# Altium project BeagleBoneBlackRTC.PrjPCB
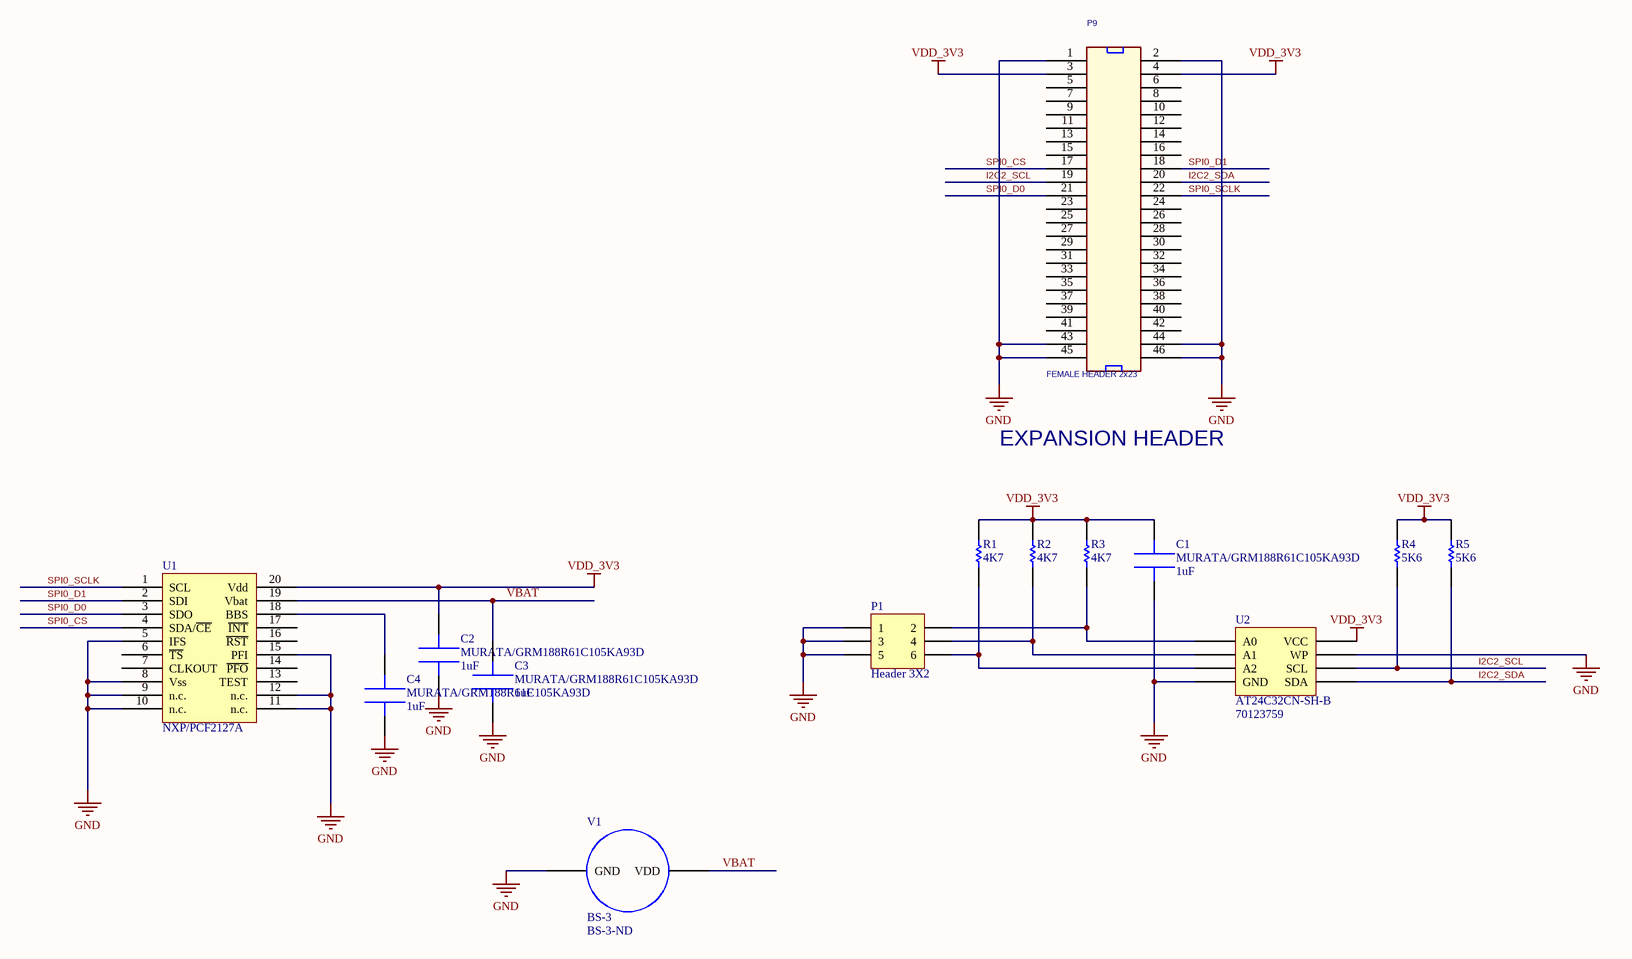
[diagram p0: BeagleBoneBlackRTC.SchDoc]
1 sheet, 14 parts. Net scope: global (net labels, ports and power ports of the same name join across sheets).
Board file: BeagleBoneBlack.PcbDoc

## Sheet BeagleBoneBlackRTC.SchDoc: BeagleBone Black RTC Cape
size B; Author: Anh Luong; CompanyName: University of Utah - WiESEL; DrawnBy: Anh Luong; Organization: WiESEL; Address1: Anh Luong; Address2: 50 S. Central Campus Dr.; Address3: Rm 1381 MEB; Address4: Salt Lake City, UT 84112-9206; DocumentNumber: 0; Revision: 2; SheetNumber: 1; SheetTotal: 1; PageSetup: Record=PageOptions|CenterHorizontal=True|CenterVertical=True|PrintScale=1.00|XCorrection=1.00|YCorrection=1.00|PrintKind=1|BorderSize=5000000|LeftOffset=0|BottomOffset=0|Orientation=2|PaperLength=1000|PaperWidth=1000|Scale=100|PaperSource=7|PrintQuality=-4|MediaType=1|DitherType=10|PaperKind=A5|PrintScaleMode=1; ImagePath: C:\Users\Anh\Dropbox\WiESEL\Documents\WiESEL.bmp; ProjectName: BeagleBone Black RTC Cape

### Parts
C1  MURATA/GRM188R61C105KA93D  value 1uF  [CAPC1608X09N (0603)]
C2  MURATA/GRM188R61C105KA93D  value 1uF  [CAPC1608X09N (0603)]
C3  MURATA/GRM188R61C105KA93D  value 1uF  [CAPC1608X09N (0603)]
C4  MURATA/GRM188R61C105KA93D  value 1uF  [CAPC1608X09N (0603)]
P1  Header 3X2  [HDR2X3]
P9  FEMALE HEADER 2x23  [HEADER23X2]
R1  4K7  [RES0603]
R2  4K7  [RES0603]
R3  4K7  [RES0603]
R4  5K6  [RES0603]
R5  5K6  [RES0603]
U1  NXP/PCF2127A  [NXP/PCF2127A SOT163-1]
U2  AT24C32CN-SH-B  Supplier Part Number 1: 70123759  [SOIC127P600X175-8N]
V1  BS-3  Supplier Part Number 1: BS-3-ND  [CR2032TH]

### Nets
GND: C1.1 C2.1 C3.1 C4.1 P1.1 P1.3 P1.5 P9.1 P9.2 P9.43 P9.44 P9.45 P9.46 U1.5(IFS) U1.8(Vss) U1.9(n.c.) U1.10(n.c.) U1.11(n.c.) U1.12(n.c.) U1.15(PFI) U2.4(GND) U2.7(WP) V1.0(GND)
VDD_3V3: C1.2 C2.2 P9.3 P9.4 R1.2 R2.2 R3.2 R4.2 R5.2 U1.20(Vdd) U2.8(VCC)
I2C2_SCL: P9.19 R4.1 U2.6(SCL)
I2C2_SDA: P9.20 R5.1 U2.5(SDA)
SPI0_CS: P9.17 U1.4(SDA/~{CE})
SPI0_D0: P9.21 U1.3(SDO)
SPI0_D1: P9.18 U1.2(SDI)
SPI0_SCLK: P9.22 U1.1(SCL)
VBAT: C3.2 U1.19(Vbat) V1.1(VDD)
NetC4_2: C4.2 U1.18(BBS)
NetP1_2: P1.2 R3.1 U2.1(A0)
NetP1_4: P1.4 R2.1 U2.2(A1)
NetP1_6: P1.6 R1.1 U2.3(A2)

Not connected (* = marked no-connect by the designer): P9 5(3) 6(28) 7(4) 8(29) 9(5) 10(30) 11(6) 12(31) 13(7) 14(32) 15(8) 16(33) 23(12) 24(37) 25(13) 26(38) 27(14) 28(39) 29(15) 30(40) 31(16) 32(41) 33(17) 34(42) 35(18) 36(43) 37(19) 38(44) 39(20) 40(45) 41(21) 42(46); U1 6(~{TS}) 7(CLKOUT) 13(TEST) 14(~{PFO}) 16(~{RST}) 17(~{INT})

### Notes on the sheet
- EXPANSION HEADER
- Title
- Size:
- Date:
- B
- Number:
- Time:
- Revision:
- Sheet
- of
- File:

### Library data of the parts
C1-C4 = MURATA/GRM188R61C105KA93D: Capacitor 0603 1uF
P1 = Header 3X2: Header, 3-Pin, Dual row; LatestRevisionDate: 17-Jul-2002; LatestRevisionNote: Re-released for DXP Platform.; Publisher: Altium Limited
P9 = HDR_46_F_2_0.1_0.1: CONN HEADER FMAL 46PS.1" DL GOLD; Manufacturer: Sullins Connector Solutions; Manufacturer Part Number: PPPC232LFBN-RC; Number of Positions: 46; Number of Positions Loaded: All; Pitch: 0.100" (2.54mm); Supplier 1: Digi-Key; Supplier Part Number 1: S7126-ND; RoHS: RoHS Compliant; Category: Connectors, Interconnects; Stock 1: 750; Pricing 1: 1=2.75, 10=2.325, 25=2.2196, 50=2.0084, 100=1.7969, 250=1.58552, 500=1.4798, 1000=1.3741, 2500=1.32125 (USD); Connector Type: Header; Contact Type: Female Socket; Number of Rows: 2; Row Spacing: 0.100" (2.54mm); Mounting Type: Through Hole; Termination: Solder; Fastening Type: -; Features: -; Contact Finish: Gold; Contact Finish Thickness: Flash; Color: Black; Packaging: Bulk; ComponentLink1URL: http://www.sullinscorp.com/drawings/78_P(N)PxCxxxLFBN-RC,_10492-G.pdf; ComponentLink1Description: http://www.sullinscorp.com/drawings/78_P(N)PxCxxxLFBN-RC,_10492-G.pdf
U1 = NXP/PCF2127A: Integrated RTC, TCXO and quartz crystal
U2 = AT24C32CN-SH-B: SERIAL EEPROM 32K 1.8V,  8 PIN SOIC; Manufacturer: Atmel; Capacitance, Input: 6; Capacitance, Output: 8; Current, Input, Leakage: 0.1; Current, Operating: 0.4 mA (Read), 2 mA (Write); Current, Output, Leakage: 0.05; Data Retention: 100 yrs.; Interface: 2-Wire; Organization: 4096&times;8; Temperature, Operating: -40 to +85; Time, Access: 0.55; Time, Fall: 100; Time, Rise: 0.3; Voltage, Input, High: 2.3 to 6; Voltage, Input, Low: 0.54 to 1.65; Voltage, Output, Low: 0.2; Voltage, Supply: 1.8 to 5.5; Order Multiple: 1; Supplier 1: Allied; Manufacturer Part Number: AT24C32CN-SH-B; RoHS: RoHS Compliant; Category: Memory; Stock 1: 0; Pricing 1: 1=$0.43, 100=$0.36, 250=$0.31 (USD); Density: 32K; Memory Type: Serial EEPROM; Package Type: JEDEC SOIC; Minimum Order Quantity: 1; Package Quantity: EA; ComponentLink1URL: http://www.alliedelec.com//www.alliedelec.com/images/products/datasheets/bm/ATMEL/70123759.pdf; ComponentLink1Description: http://www.alliedelec.com//www.alliedelec.com/images/products/datasheets/bm/ATMEL/70123759.pdf
V1 = BS-3: HOLDER COINCELL 2032 RETAINR ARM; Manufacturer: MPD (Memory Protection Devices); Battery Type, Function: Coin Cell, Holder; Style: Holder (Open); Battery Cell Size: Coin, 20.0mm; Number of Cells: 1; Battery Series: 2032; Supplier 1: Digi-Key; Manufacturer Part Number: BS-3; RoHS: RoHS Compliant; Category: Battery Products; Stock 1: 12851; Pricing 1: 1=0.79, 10=0.733, 100=0.66, 500=0.58, 1000=0.51 (USD); Mounting Type: PCB, Through Hole; Termination Style: PC Pin; Height Above Board: -; Operating Temperature: -55°C ~ 105°C; ComponentLink1URL: http://www.memoryprotectiondevices.com/datasheets/BS-3-datasheet.pdf; ComponentLink1Description: http://www.memoryprotectiondevices.com/datasheets/BS-3-datasheet.pdf